# EAGLE design flasher (EAGLE 9.6.1)
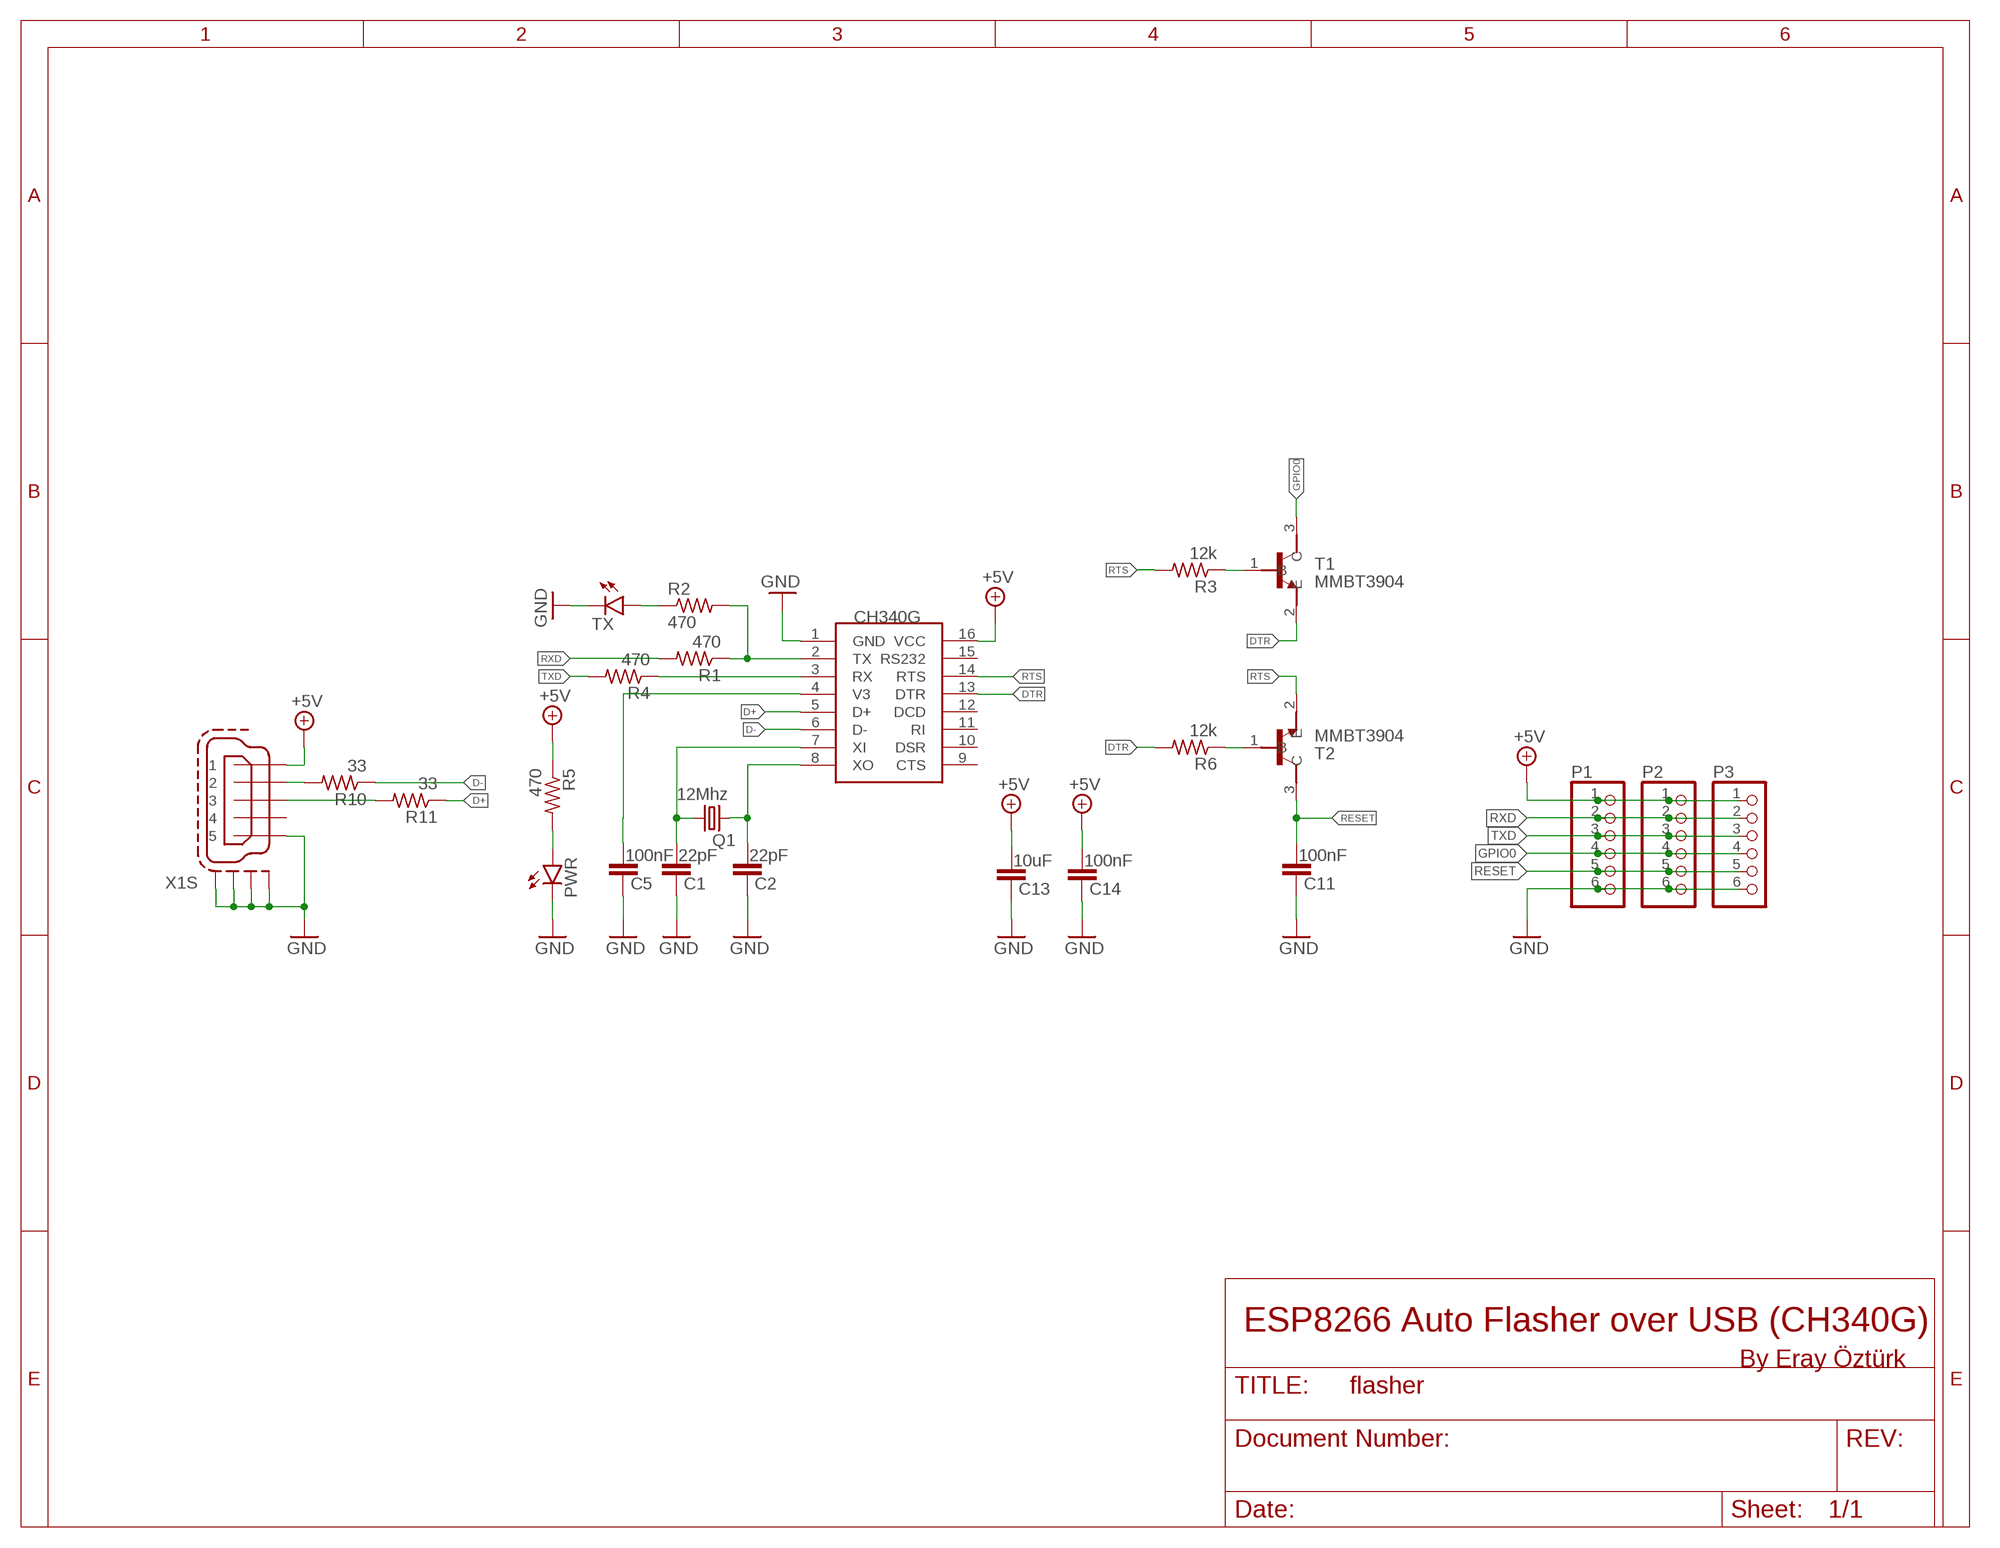
[diagram p0: schematic, sheet 1]

## Parts
C1  22pF  C-EUC0805  [C0805]
C2  22pF  C-EUC0805  [C0805]
C5  100nF  C-EUC0805  [C0805]
C11  100nF  C-EUC0805  [C0805]
C13  10uF  C-EUC0805  [C0805]
C14  100nF  C-EUC0805  [C0805]
P1  PINHD-1X6  [1X06]
P2  PINHD-1X6  [1X06]
P3  PINHD-1X6  [1X06]
PWR  LEDCHIP-LED0805  [CHIP-LED0805]
Q1  12Mhz  CRYSTALHC49S  [HC49/S]
R1  470  R-US_M0805  [M0805]
R2  470  R-US_M0805  [M0805]
R3  12k  R-US_M0805  [M0805]
R4  470  R-US_M0805  [M0805]
R5  470  R-US_M0805  [M0805]
R6  12k  R-US_M0805  [M0805]
R10  33  R-US_M0805  [M0805]
R11  33  R-US_M0805  [M0805]
T1  MMBT3904  [SOT95P240X120-3N]
T2  MMBT3904  [SOT95P240X120-3N]
TX  LEDCHIP-LED0805  [CHIP-LED0805]
U1  CH340G  [SOIC16]
X1  MINI-USB-SCHIELD-32005-201  [32005-201]

## Nets
+5V: C13.2 C14.2 P1.1 P2.1 P3.1 R5.1 U1.16(VCC) X1.1
D+: R11.1 U1.5(D+)
D-: R10.1 U1.6(D-)
DTR: R6.2 T1.2(E) U1.13(DTR)
GND: C1.1 C2.1 C5.1 C11.1 C13.1 C14.1 P1.6 P2.6 P3.6 PWR.C TX.C U1.1(GND) X1.5 X1.M1(S:S1) X1.M2(S:S2) X1.M3(S:S3) X1.M4(S:S4)
GPIO0: P1.4 P2.4 P3.4 T1.3(C)
N$1: R1.1 R2.2 U1.2(TX)
N$2: R4.1 U1.3(RX)
N$3: PWR.A R5.2
N$4: R2.1 TX.A
N$5: R3.1 T1.1(B)
N$6: R6.1 T2.1(B)
N$8: R10.2 X1.2
N$9: R11.2 X1.3
N$12: C5.2 U1.4(V3)
N$16: C1.2 Q1.1 U1.7(XI)
N$17: C2.2 Q1.2 U1.8(XO)
RESET: C11.2 P1.5 P2.5 P3.5 T2.3(C)
RTS: R3.2 T2.2(E) U1.14(RTS)
RXD: P1.2 P2.2 P3.2 R1.2
TXD: P1.3 P2.3 P3.3 R4.2
Unconnected: U1.9(CTS) U1.10(DSR) U1.11(RI) U1.12(DCD) U1.15(RS232) X1.4

## Notes on the sheet
- ESP8266 Auto Flasher over USB (CH340G)
- By Eray Öztürk

## Library data of the parts
C1 C2 C5 C11 C13 C14 = rcl:C-EU: CAPACITOR, European symbol; SPICEPREFIX: C
P1-P3 = pinhead:PINHD-1X6: PIN HEADER
PWR TX = led:LED: LED OSRAM: - CHIPLED LG R971, LG N971, LY N971, LG Q971, LY Q971, LO R971, LY R971 LH N974, LH R974 LS Q976, LO Q976, LY Q976 LO Q996 - Hyper CHIPLED LW Q18S LB Q993, LB Q99A, LB R99A - SideLED LS A670, LO A670, LY A670, LG A670, LP A670 LB A673, LV A673, LT A673, LW A673 LH A674 LY A675 LS A676, LA A676, LO A676, LY A676, LW A676 LS A679, LY A679, LG A679 - Hyper Micro SIDELED® LS Y876, LA Y876, LO Y876, LY Y876 LT Y87S - SmartLED LW L88C, LW L88S LB L89C, LB L89S, LG L890 LS L89K, LO L89K, LY L89K LS L896, LA L896, LO L896, LY L896 - TOPLED LS T670, LO T670, LY T670, LG T670, LP T670 LSG T670, LSP T670, LSY T670, LOP T670, LYG T670 LG T671, LOG T671, LSG T671 LB T673, LV T673, LT T673, LW T673 LH T674 LS T676, LA T676, LO T676, LY T676, LB T676, LH T676, LSB T676, LW T676 LB T67C, LV T67C, LT T67C, LS T67K, LO T67K, LY T67K, LW E67C LS E67B, LA E67B, LO E67B, LY E67B, LB E67C, LV E67C, LT E67C LW T67C LS T679, LY T679, LG T679 LS T770, LO T770, LY T770, LG T770, LP T770 LB T773, LV T773, LT T773, LW T773 LH T774 LS E675, LA E675, LY E675, LS T675 LS T776, LA T776, LO T776, LY T776, LB T776 LHGB T686 LT T68C, LB T68C - Hyper Mini TOPLED® LB M676 - Mini TOPLED Santana® LG M470 LS M47K, LO M47K, LY M47K Source: http://www.osram.convergy.de LUXEON: - LUMILED® LXK2-PW12-R00, LXK2-PW12-S00, LXK2-PW14-U00, LXK2-PW14-V00 LXK2-PM12-R00, LXK2-PM12-S00, LXK2-PM14-U00 LXK2-PE12-Q00, LXK2-PE12-R00, LXK2-PE12-S00, LXK2-PE14-T00, LXK2-PE14-U00 LXK2-PB12-K00, LXK2-PB12-L00, LXK2-PB12-M00, LXK2-PB14-N00, LXK2-PB14-P00, LXK2-PB14-Q00 LXK2-PR12-L00, LXK2-PR12-M00, LXK2-PR14-Q00, LXK2-PR14-R00 LXK2-PD12-Q00, LXK2-PD12-R00, LXK2-PD12-S00 LXK2-PH12-R00, LXK2-PH12-S00 LXK2-PL12-P00, LXK2-PL12-Q00, LXK2-PL12-R00 Source: www.luxeon.com KINGBRIGHT: KA-3528ASYC Source: www.kingbright.com
Q1 = crystal:CRYSTAL: CRYSTAL; OC_FARNELL: 1667008; OC_NEWARK: unknown
R1-R6 R10 R11 = rcl:R-US_: RESISTOR, American symbol; SPICEPREFIX: R
T1 T2 = MMBT3904:MMBT3904: MMBT3904 Series 40 V CE Breakdown 0.2 A NPN General Purpose Amplifier - SOT-23; AVAILABILITY: Unavailable; DESCRIPTION: Bipolar _BJT_ Transistor NPN 40V 200mA 270MHz 350mW Surface Mount SOT-23-3; MF: STMicroelectronics; MP: MMBT3904; PACKAGE: SOT-23-3 Taiwan Semiconductor; PRICE: None
U1 = ch340g:CH340G
X1 = con-cypressindustries:MINI-USB-SCHIELD-: MINI USB-B Conector Source: www.cypressindustries.com; OC_FARNELL: unknown; OC_NEWARK: unknown

## Board
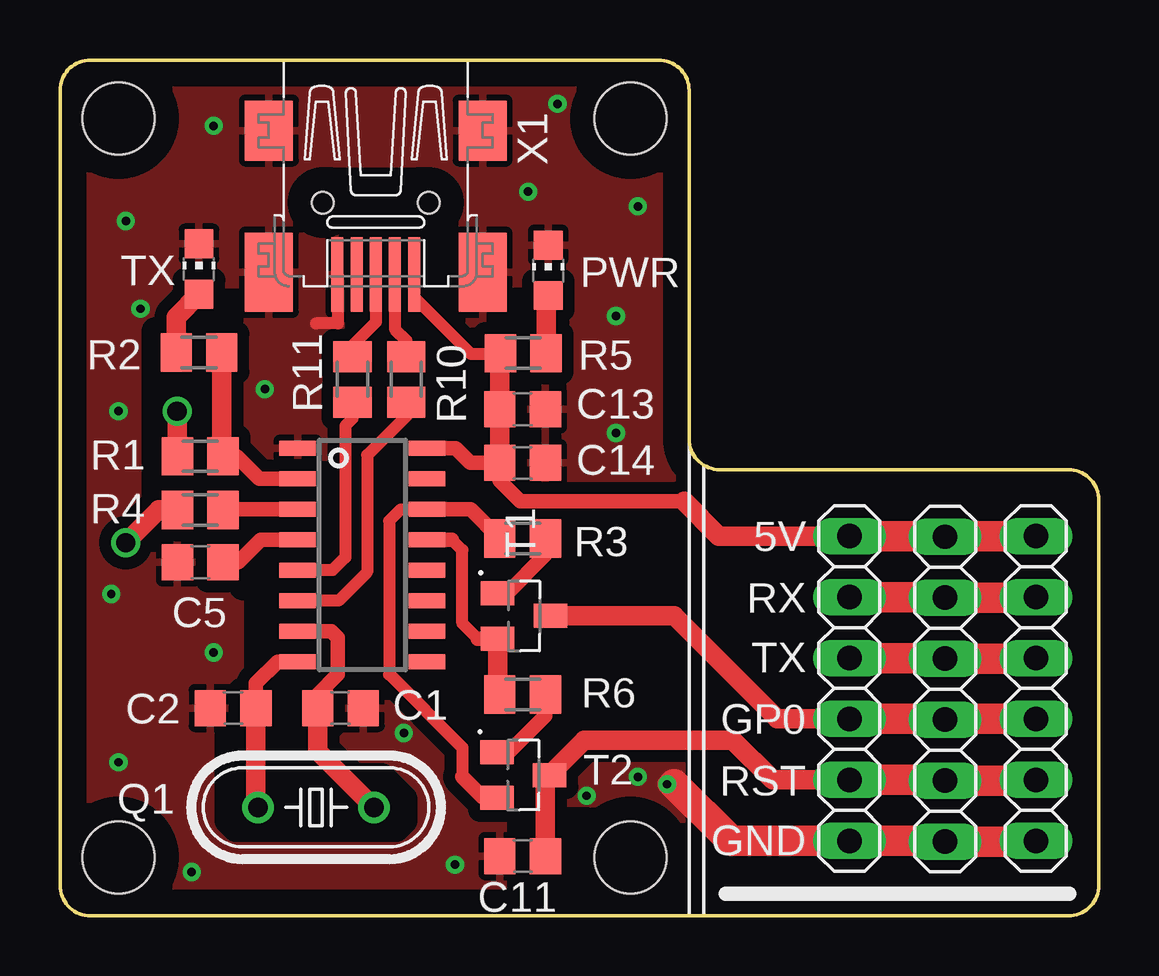
[diagram p1: board, top side]
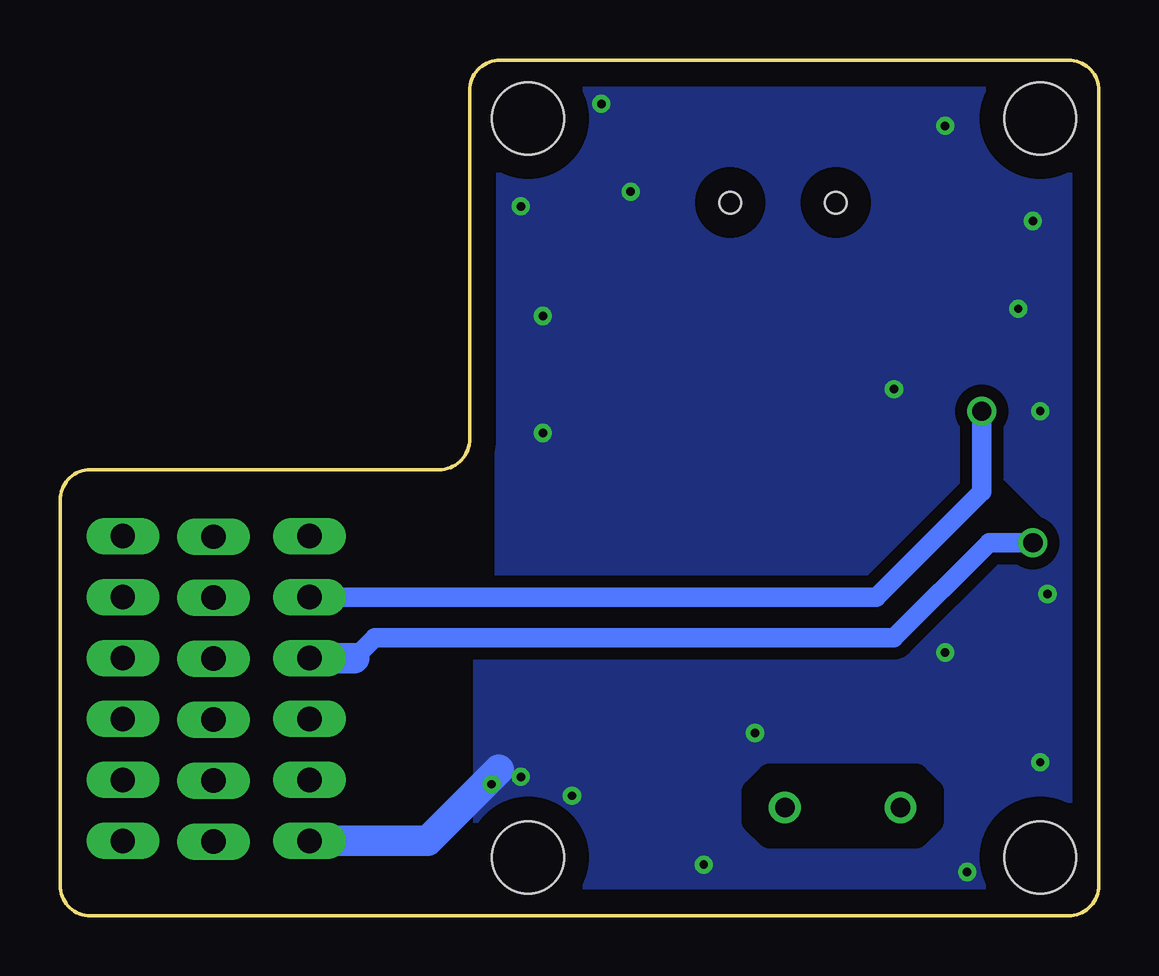
[diagram p2: board, bottom side, seen from below]

Size 43.28 x 35.66 mm. Coordinates in mm from the lower left corner, seen from the top.
Outline: 1.27,35.66 24.94,35.66 arc-90 26.21,34.39 26.21,19.86 arc90 27.48,18.59 42.01,18.59 arc-90 43.28,17.32 43.28,1.27 arc-90 42.01,0 1.27,0 arc-90 0,1.27 0,34.39 arc-90 1.27,35.66
Copper layers (1*16): Top 0.035mm / dielectric 1.5mm / Bottom 0.035mm
Design rules "default": minimum track width 6mil, minimum drill 0.35mm, track to track 6mil, track to pad 6mil, pad to pad 6mil, via to via 6mil, smd to smd 6mil, copper to edge 40mil, drill to drill 6mil, minimum pad ring 10mil, minimum via ring 8mil, stop-mask expansion 4mil, vias tented up to drill 0mil, thermal gap 10mil
Holes 3 mm at 2.44,2.44 2.44,33.22 23.77,33.22 23.77,2.44
tRestrict: 19 lines
bRestrict: 10 lines

### Footprints (pad centres in the part's own frame; a part is rotated, then mirrored left to right if it is on the bottom)
C0805 = smd 1.3 x 1.5: 1 -0.95,0; 2 0.95,0
1X06 = drill 1.016 long: 1 -6.35,0; 2 -3.81,0; 3 -1.27,0; 4 1.27,0; 5 3.81,0; 6 6.35,0
CHIP-LED0805 = smd 1.2 x 1.2: A 0,-1.05; C 0,1.05
HC49/S = drill 0.813: 1 -2.413,0; 2 2.413,0
M0805 = smd 1.3 x 1.6: 1 -0.95,0; 2 0.95,0
SOT95P240X120-3N = smd 1 x 1.4: 1 -0.95,-1.1; 2 0.95,-1.1; 3 0,1.1
SOIC16 = smd 0.635 x 1.524: 1 -4.445,-2.695; 2 -3.175,-2.695; 3 -1.905,-2.695; 4 -0.635,-2.695; 5 0.635,-2.695; 6 1.905,-2.695; 7 3.175,-2.695; 8 4.445,-2.695; 9 4.445,2.695; 10 3.175,2.695; 11 1.905,2.695; 12 0.635,2.695; 13 -0.635,2.695; 14 -1.905,2.695; 15 -3.175,2.695; 16 -4.445,2.695
32005-201 = smd 3.1 x 0.5: 1 3,1.6; 2 3,0.8; 3 3,0; 4 3,-0.8; 5 3,-1.6 | smd 2.5 x 2: M1 -3,-4.45; M2 -3,4.45 | smd 3.3 x 2: M3 2.9,4.45; M4 2.9,-4.45 | hole 0.9: 0,2.2; 0,-2.2

### Placement (x,y rotation side)
C1  11.68,8.66 180 top
C2  7.21,8.66 0 top
C5  5.84,14.73 0 top
C11  19.28,2.49 0 top
C13  19.28,21.11 180 top
C14  19.28,18.87 180 top
P1  40.67,9.47 270 top
P2  36.88,9.45 270 top
P3  32.89,9.47 270 top
PWR  20.35,26.9 0 top
Q1  10.67,4.52 180 top
R1  5.84,19.15 180 top
R2  5.79,23.47 0 top
R3  19.28,15.72 180 top
R4  5.84,16.92 180 top
R5  19.3,23.44 0 top
R6  19.28,9.22 180 top
R10  14.43,22.35 90 top
R11  12.19,22.35 90 top
T1  19.33,12.5 270 top
T2  19.3,5.87 270 top
TX  5.79,26.95 0 top
U1  12.6,15.04 270 top
X1  13.16,29.72 270 top

### Tracks (layer width: path | path; a pad name or v marks a point on that pad's centre or on a via)
+5V
  Top 0.5: R5.1 18.33,23.42 17.12,23.42 14.76,25.78 X1.1
  Top 0.61: U1.16 16.48,19.48 17.09,18.87 C14.2 18.33,18.12 19.18,17.27 26.01,17.27
  Top 0.813: C14.2 C13.2 18.33,23.42 | P3.1 27.46,15.82 26.01,17.27
  Top 1.27: P3.1 36.86,15.82 P2.1 36.91,15.82 P1.1
D+
  Top 0.5: R11.1 12.19,20.73 11.89,20.42 11.89,14.94 11.35,14.4 U1.5
D-
  Top 0.5: R10.1 14.43,20.83 12.8,19.2 12.8,14.33 11.61,13.13 U1.6
DTR
  Top 0.5: R6.2 18.23,9.32 | 17.41,11.55 16.76,12.19 16.76,15.24 16.33,15.67
  Top 0.61: T1.2 17.41,11.55 | 16.33,15.67 U1.13
  Top 0.813: 18.23,9.32 T1.2
GND  (via drill 0.35)
  Top 0.508: X1.5 11.58,26.69 11.58,24.69 10.67,24.69
  Top 0.813: 25.6,5.49 v25.3,5.49
  Top 1.27: 25.6,5.49 27.97,3.12 P3.6 36.86,3.12 P2.6 40.64,3.1 P1.6
  Bottom 1.27: P3.6 27.97,3.12 24.99,6.1
  other vias: 2.74,28.96 6.4,32.92 8.53,21.95 2.44,21.03 6.4,10.97 2.13,13.41 2.44,6.4 5.49,1.83 16.46,2.13 14.33,7.62 23.16,20.12 3.35,25.3 23.16,24.99 19.51,30.18 24.08,29.57 20.73,33.83 24.08,5.79 21.95,5
  pour Top (isolate 0.5): 0.3,1.25 0.3,34.09 arc-90 1.57,35.36 24.77,35.36 arc-45 25.67,34.98 arc-45 25.91,34.41 25.91,1.57 arc-90 24.64,0.3 1.44,0.3 arc-45 0.54,0.68 arc-45
  pour Bottom (isolate 0.5): 0.3,1.25 0.3,34.09 arc-90 1.57,35.36 24.77,35.36 arc-45 25.67,34.98 arc-45 25.91,34.41 25.91,1.57 arc-90 24.64,0.3 1.44,0.3 arc-45 0.54,0.68 arc-45
GPIO0
  Top 0.813: T1.3 25.6,12.5 29.9,8.2 P3.4
  Top 1.27: P3.4 36.86,8.2 P2.4 36.91,8.2 P1.4
N$1
  Top 0.61: U1.2 8.31,18.21 7.37,19.15 R1.1
  Top 0.813: R1.1 6.74,19.2 R2.2
N$2
  Top 0.5: 6.82,16.94 R4.1
  Top 0.61: U1.3 6.82,16.94
N$3
  Top 0.5: 20.25,25.76 PWR.A
  Top 0.813: R5.2 20.25,25.76
N$4
  Top 0.813: R2.1 4.84,24.95 TX.A
N$5
  Top 0.5: R3.1 20.23,15.05 | 18.63,13.45 T1.1
  Top 0.61: 20.23,15.05 18.63,13.45
N$6
  Top 0.5: 18.7,6.82 T2.1
  Top 0.61: R6.1 20.23,8.34 18.7,6.82
N$8
  Top 0.5: X1.2 13.96,24.45 14.43,23.98 R10.2
N$9
  Top 0.5: X1.3 13.16,24.74 12.19,23.77 R11.2
N$12
  Top 0.61: U1.4 8.36,15.67 7.42,14.73 C5.2
N$16
  Top 0.5: 10.73,9.21 C1.2
  Top 0.61: U1.7 11.3,11.86 11.58,11.58 11.58,10.06 10.73,9.21
  Top 0.813: C1.2 10.73,6.87 Q1.1
N$17
  Top 0.61: C2.2 8.16,9.69 9.07,10.59 U1.8
  Top 0.813: C2.2 8.16,4.61 Q1.2
RESET
  Top 0.5: 20.61,5.66 T2.3 20.23,5.69
  Top 0.813: C11.2 20.23,5.69 21.85,7.32 28.04,7.32 29.69,5.66 P3.5
  Top 1.27: P3.5 36.86,5.66 P2.5 40.64,5.64 P1.5
RTS
  Top 0.5: 18.02,16.03 R3.2 | U1.14 14.2,16.94 13.72,16.46 13.72,10.06 16.76,7.01 16.76,5.79 | 17.64,4.92 T2.2
  Top 0.61: R3.2 17.11,16.94 U1.14 | 16.76,5.79 17.64,4.92
RXD  (via drill 0.8)
  Top 0.813: R1.2 4.88,19.17 v4.88,21.03
  Top 1.27: P3.2 36.86,13.28 P2.2 40.64,13.26 P1.2
  Bottom 0.813: P3.2 9.27,13.28 4.88,17.68 v4.88,21.03
TXD  (via drill 0.8)
  Top 0.813: R4.2 4.12,16.92 v2.74,15.55
  Top 1.27: P3.3 36.86,10.74 P2.3 40.64,10.72 P1.3
  Bottom 0.813: v2.74,15.55 4.57,15.55 8.53,11.58 30.18,11.58 31.01,10.74
  Bottom 1.27: P3.3 31.01,10.74

### Text on the board
tNames: 5V | RX | TX | GP0 | RST | GND